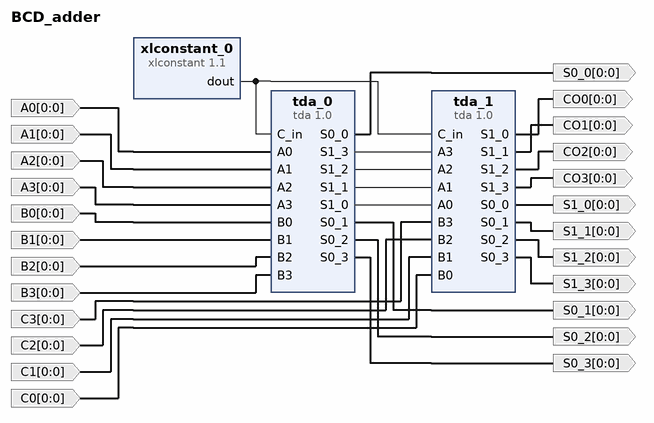
[diagram p0: block diagram of the top level]
# Vivado block design BCD_adder, xc7vx485tffg1157-1, Vivado 2019.1
create_bd_design BCD_adder

create_bd_port -dir I -from 0 -to 0 A0
create_bd_port -dir I -from 0 -to 0 A1
create_bd_port -dir I -from 0 -to 0 A2
create_bd_port -dir I -from 0 -to 0 A3
create_bd_port -dir I -from 0 -to 0 B0
create_bd_port -dir I -from 0 -to 0 B1
create_bd_port -dir I -from 0 -to 0 B2
create_bd_port -dir I -from 0 -to 0 B3
create_bd_port -dir I -from 0 -to 0 C0
create_bd_port -dir I -from 0 -to 0 C1
create_bd_port -dir I -from 0 -to 0 C2
create_bd_port -dir I -from 0 -to 0 C3
create_bd_port -dir O -from 0 -to 0 S0_0
create_bd_port -dir O -from 0 -to 0 S0_1
create_bd_port -dir O -from 0 -to 0 S0_2
create_bd_port -dir O -from 0 -to 0 S0_3
create_bd_port -dir O -from 0 -to 0 S1_0
create_bd_port -dir O -from 0 -to 0 S1_1
create_bd_port -dir O -from 0 -to 0 S1_2
create_bd_port -dir O -from 0 -to 0 S1_3
create_bd_port -dir O -from 0 -to 0 CO0
create_bd_port -dir O -from 0 -to 0 CO1
create_bd_port -dir O -from 0 -to 0 CO2
create_bd_port -dir O -from 0 -to 0 CO3

create_bd_cell -type ip -vlnv xilinx.com:ip:xlconstant:1.1 xlconstant_0
create_bd_cell -type ip -vlnv Group5:user:tda:1.0 tda_0
create_bd_cell -type ip -vlnv Group5:user:tda:1.0 tda_1

# ---- connections ----

connect_bd_net -net A0_1 [get_bd_ports A0] [get_bd_pins tda_0/A0]
connect_bd_net -net A1_1 [get_bd_ports A1] [get_bd_pins tda_0/A1]
connect_bd_net -net A2_1 [get_bd_ports A2] [get_bd_pins tda_0/A2]
connect_bd_net -net A3_1 [get_bd_ports A3] [get_bd_pins tda_0/A3]
connect_bd_net -net B0_1 [get_bd_ports B0] [get_bd_pins tda_0/B0]
connect_bd_net -net B1_1 [get_bd_ports B1] [get_bd_pins tda_0/B1]
connect_bd_net -net B2_1 [get_bd_ports B2] [get_bd_pins tda_0/B2]
connect_bd_net -net B3_1 [get_bd_ports B3] [get_bd_pins tda_0/B3]
connect_bd_net [get_bd_pins xlconstant_0/dout] [get_bd_pins tda_0/C_in] [get_bd_pins tda_1/C_in]
connect_bd_net -net C3_1 [get_bd_ports C3] [get_bd_pins tda_1/B3]
connect_bd_net -net C2_1 [get_bd_ports C2] [get_bd_pins tda_1/B2]
connect_bd_net -net C1_1 [get_bd_ports C1] [get_bd_pins tda_1/B1]
connect_bd_net -net C0_1 [get_bd_ports C0] [get_bd_pins tda_1/B0]
connect_bd_net [get_bd_pins tda_0/S1_3] [get_bd_pins tda_1/A3]
connect_bd_net [get_bd_pins tda_0/S1_2] [get_bd_pins tda_1/A2]
connect_bd_net [get_bd_pins tda_0/S1_1] [get_bd_pins tda_1/A1]
connect_bd_net [get_bd_pins tda_0/S1_0] [get_bd_pins tda_1/A0]
connect_bd_net [get_bd_pins tda_0/S0_0] [get_bd_ports S0_0]
connect_bd_net [get_bd_pins tda_0/S0_1] [get_bd_ports S0_1]
connect_bd_net [get_bd_pins tda_0/S0_2] [get_bd_ports S0_2]
connect_bd_net [get_bd_pins tda_0/S0_3] [get_bd_ports S0_3]
connect_bd_net [get_bd_pins tda_1/S0_0] [get_bd_ports S1_0]
connect_bd_net [get_bd_pins tda_1/S0_1] [get_bd_ports S1_1]
connect_bd_net [get_bd_pins tda_1/S0_2] [get_bd_ports S1_2]
connect_bd_net [get_bd_pins tda_1/S0_3] [get_bd_ports S1_3]
connect_bd_net [get_bd_pins tda_1/S1_0] [get_bd_ports CO0]
connect_bd_net [get_bd_pins tda_1/S1_1] [get_bd_ports CO1]
connect_bd_net [get_bd_pins tda_1/S1_2] [get_bd_ports CO2]
connect_bd_net [get_bd_pins tda_1/S1_3] [get_bd_ports CO3]

validate_bd_design
save_bd_design
